# Altium schematic sheet Decoupling CAP.SchDoc
size A4
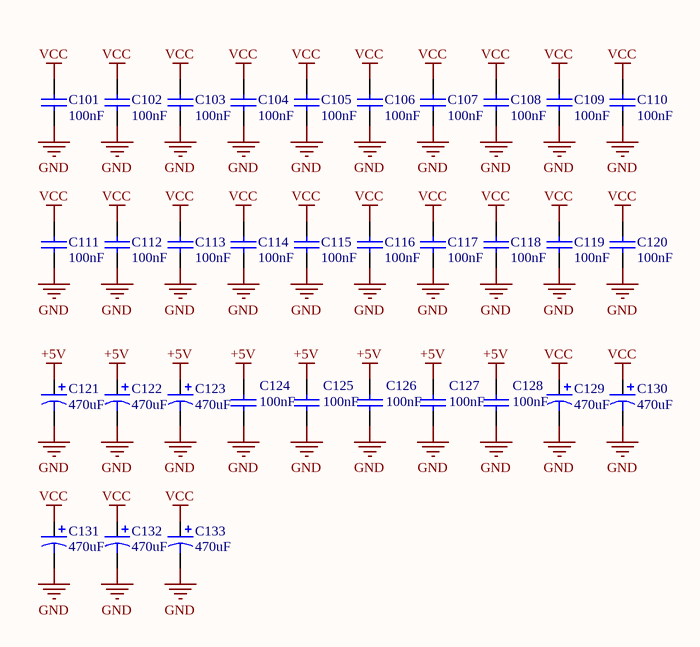
[diagram p0: Decoupling CAP.SchDoc]

## Parts
C101  100nF  [CAPC0603(1608)55_M]
C102  100nF  [CAPC0603(1608)55_M]
C103  100nF  [CAPC0603(1608)55_M]
C104  100nF  [CAPC0603(1608)55_M]
C105  100nF  [CAPC0603(1608)55_M]
C106  100nF  [CAPC0603(1608)55_M]
C107  100nF  [CAPC0603(1608)55_M]
C108  100nF  [CAPC0603(1608)55_M]
C109  100nF  [CAPC0603(1608)55_M]
C110  100nF  [CAPC0603(1608)55_M]
C111  100nF  [CAPC0603(1608)55_M]
C112  100nF  [CAPC0603(1608)55_M]
C113  100nF  [CAPC0603(1608)55_M]
C114  100nF  [CAPC0603(1608)55_M]
C115  100nF  [CAPC0603(1608)55_M]
C116  100nF  [CAPC0603(1608)55_M]
C117  100nF  [CAPC0603(1608)55_M]
C118  100nF  [CAPC0603(1608)55_M]
C119  100nF  [CAPC0603(1608)55_M]
C120  100nF  [CAPC0603(1608)55_M]
C121  470uF  [CAPC7343]
C122  470uF  [CAPC7343]
C123  470uF  [CAPC7343]
C124  100nF  [CAPC0603(1608)55_M]
C125  100nF  [CAPC0603(1608)55_M]
C126  100nF  [CAPC0603(1608)55_M]
C127  100nF  [CAPC0603(1608)55_M]
C128  100nF  [CAPC0603(1608)55_M]
C129  470uF  [CAPC7343]
C130  470uF  [CAPC7343]
C131  470uF  [CAPC7343]
C132  470uF  [CAPC7343]
C133  470uF  [CAPC7343]

## Nets
+5V: C121.1 C122.1 C123.1 C124.2 C125.2 C126.2 C127.2 C128.2
GND: C101.1 C102.1 C103.1 C104.1 C105.1 C106.1 C107.1 C108.1 C109.1 C110.1 C111.1 C112.1 C113.1 C114.1 C115.1 C116.1 C117.1 C118.1 C119.1 C120.1 C121.2 C122.2 C123.2 C124.1 C125.1 C126.1 C127.1 C128.1 C129.2 C130.2 C131.2 C132.2 C133.2
VCC: C101.2 C102.2 C103.2 C104.2 C105.2 C106.2 C107.2 C108.2 C109.2 C110.2 C111.2 C112.2 C113.2 C114.2 C115.2 C116.2 C117.2 C118.2 C119.2 C120.2 C129.1 C130.1 C131.1 C132.1 C133.1

## Library data of the parts
C101-C120 C124-C128 = CAP
C121-C123 C129-C133 = CAP-Pol